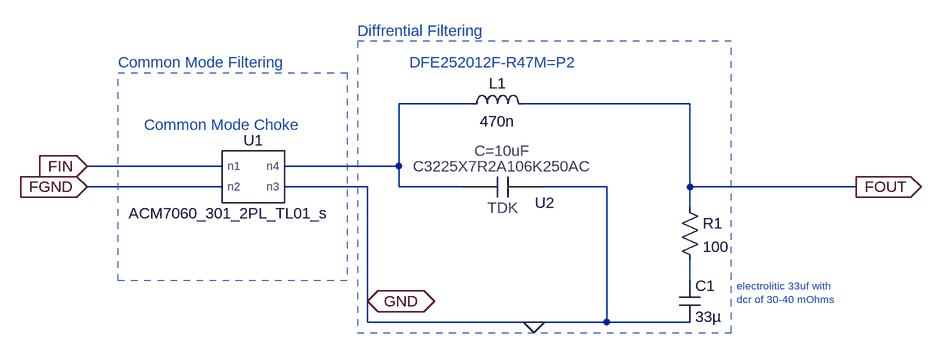
[diagram p0: schematic Filter.asc]
Filter.asc, the LTspice schematic file:
Version 4.1
SHEET 1 1328 680
WIRE 432 80 320 80
WIRE 768 80 512 80
WIRE 48 176 -160 176
WIRE 320 176 320 80
WIRE 320 176 144 176
WIRE 48 208 -160 208
WIRE 272 208 144 208
WIRE 320 208 320 176
WIRE 416 208 320 208
WIRE 640 208 544 208
WIRE 768 208 768 80
WIRE 1024 208 768 208
WIRE 768 240 768 208
WIRE 768 352 768 320
WIRE 272 384 272 208
WIRE 272 416 272 384
WIRE 528 416 272 416
WIRE 640 416 640 208
WIRE 640 416 528 416
WIRE 768 416 640 416
FLAG -160 176 FIN
IOPIN -160 176 In
FLAG 1024 208 FOUT
IOPIN 1024 208 Out
FLAG -160 208 FGND
IOPIN -160 208 In
FLAG 272 384 GND
IOPIN 272 384 BiDir
FLAG 528 416 0
SYMBOL ACM7060_301_2PL_TL01_s 96 192 R0
WINDOW 3 -36 41 Top 2
SYMATTR InstName U1
SYMBOL C3225X7R2A106K250AC_b 480 208 R180
SYMATTR InstName U2
SYMBOL ind 416 96 R270
WINDOW 0 32 56 VTop 2
WINDOW 3 5 56 VBottom 2
SYMATTR InstName L1
SYMATTR Value 470n
SYMATTR SpiceLine Ipk=15 Rser=0.00275
SYMBOL cap 752 352 R0
SYMATTR Value 33µ
SYMATTR InstName C1
SYMATTR SpiceLine V=100 Irms=135m Rser=0.3 Lser=500p mfg="Würth Elektronik" pn="865080857007 WCAP-ASLI 10x10,5" type="Al electrolytic"
SYMBOL res 752 224 R0
SYMATTR InstName R1
SYMATTR Value 100
SYMATTR SpiceLine tol=1
TEXT 336 16 Left 2 ;DFE252012F-R47M=P2
TEXT 840 360 Left 1 ;electrolitic 33uf with \ndcr of 30-40 mOhms
TEXT -72 112 Left 2 ;Common Mode Choke
TEXT 256 -32 Left 2 ;Diffrential Filtering
TEXT -112 16 Left 2 ;Common Mode Filtering
RECTANGLE Normal 832 -16 256 432 2
RECTANGLE Normal 240 352 -112 32 2

The netlist it stands for:
* Filter.asc
X§U1 FIN FGND 0 N001 ACM7060_301_2PL_TL01_s  ; pins n1 n2 n3 n4
X§U2 0 N001 C3225X7R2A106K250AC_b  ; pins 1 2
L1 N001 FOUT 470n Ipk=15 Rser=0.00275
C1 N002 0 33µ V=100 Irms=135m Rser=0.3 Lser=500p mfg="Würth Elektronik" pn="865080857007 WCAP-ASLI 10x10,5" type="Al electrolytic"
R1 FOUT N002 100 tol=1
* DFE252012F-R47M=P2
* electrolitic 33uf with
* dcr of 30-40 mOhms
* Common Mode Choke
* Diffrential Filtering
* Common Mode Filtering
.lib acm7060_301_2pl_tl01_s.lib
.lib C3225X7R2A106K250AC_b_LTspice.mod
.backanno
.end